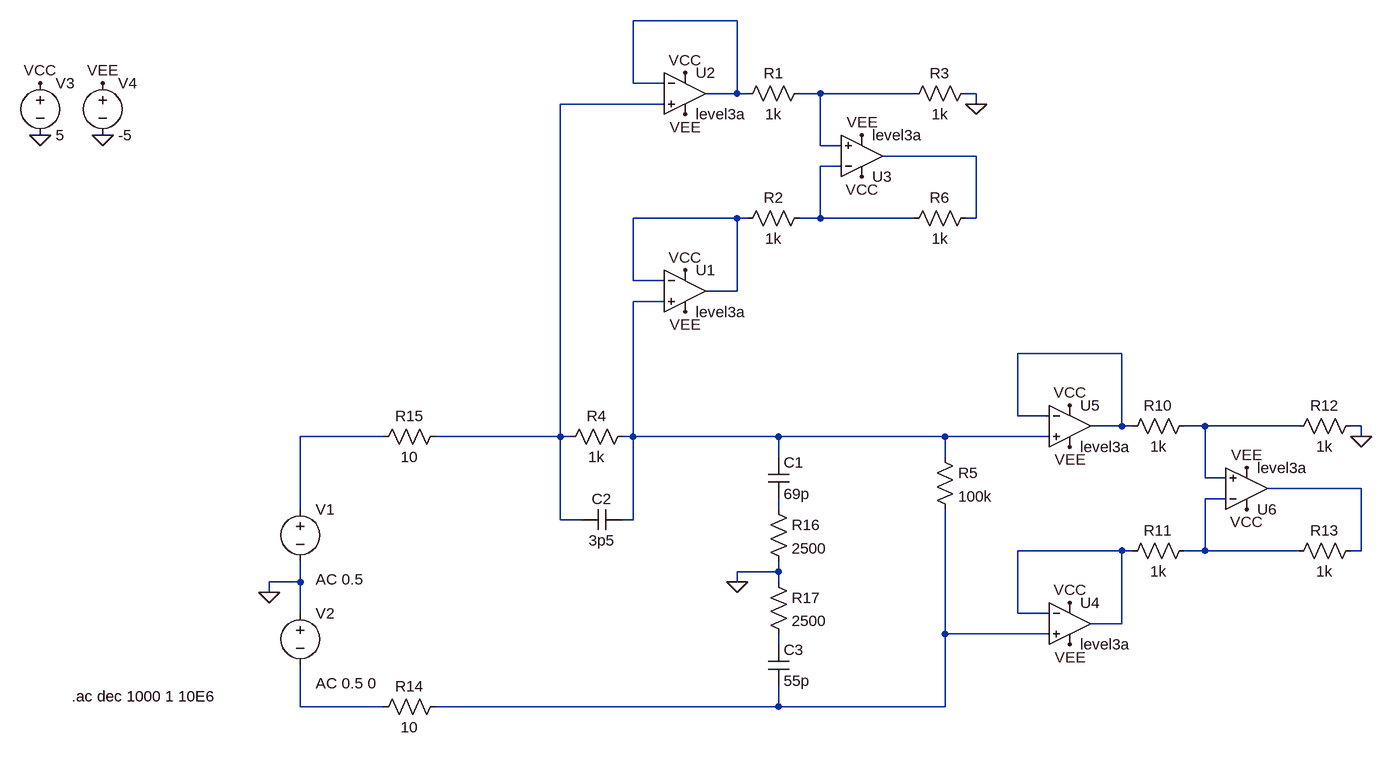
[diagram p0: schematic OpenShort.asc]
OpenShort.asc, the LTspice schematic file:
Version 4
SHEET 1 2248 1300
WIRE 368 128 208 128
WIRE 208 224 208 128
WIRE 256 224 208 224
WIRE 368 240 368 128
WIRE 368 240 320 240
WIRE 384 240 368 240
WIRE 496 240 464 240
WIRE 640 240 496 240
WIRE 736 240 720 240
WIRE 256 256 96 256
WIRE 736 256 736 240
WIRE 496 320 496 240
WIRE 528 320 496 320
WIRE 736 336 592 336
WIRE 528 352 496 352
WIRE 368 432 208 432
WIRE 384 432 368 432
WIRE 496 432 496 352
WIRE 496 432 464 432
WIRE 640 432 496 432
WIRE 736 432 736 336
WIRE 736 432 720 432
WIRE 208 528 208 432
WIRE 256 528 208 528
WIRE 368 544 368 432
WIRE 368 544 320 544
WIRE 256 560 208 560
WIRE 960 640 800 640
WIRE 800 736 800 640
WIRE 848 736 800 736
WIRE 960 752 960 640
WIRE 960 752 912 752
WIRE 976 752 960 752
WIRE 1088 752 1056 752
WIRE 1232 752 1088 752
WIRE 1328 752 1312 752
WIRE -176 768 -304 768
WIRE 96 768 96 256
WIRE 96 768 -96 768
WIRE 112 768 96 768
WIRE 208 768 208 560
WIRE 208 768 192 768
WIRE 432 768 208 768
WIRE 688 768 432 768
WIRE 848 768 688 768
WIRE 1328 768 1328 752
WIRE 432 800 432 768
WIRE 688 800 688 768
WIRE 1088 832 1088 752
WIRE 1120 832 1088 832
WIRE 1328 848 1184 848
WIRE 1120 864 1088 864
WIRE -304 880 -304 768
WIRE 432 880 432 864
WIRE 96 896 96 768
WIRE 128 896 96 896
WIRE 208 896 208 768
WIRE 208 896 192 896
WIRE 960 944 800 944
WIRE 976 944 960 944
WIRE 1088 944 1088 864
WIRE 1088 944 1056 944
WIRE 1232 944 1088 944
WIRE 1328 944 1328 848
WIRE 1328 944 1312 944
WIRE 432 976 432 960
WIRE 432 976 368 976
WIRE -304 992 -304 960
WIRE -304 992 -352 992
WIRE 368 992 368 976
WIRE 432 992 432 976
WIRE -352 1008 -352 992
WIRE -304 1040 -304 992
WIRE 800 1040 800 944
WIRE 848 1040 800 1040
WIRE 960 1056 960 944
WIRE 960 1056 912 1056
WIRE 688 1072 688 880
WIRE 848 1072 688 1072
WIRE 432 1088 432 1072
WIRE -304 1184 -304 1120
WIRE -176 1184 -304 1184
WIRE 432 1184 432 1152
WIRE 432 1184 -96 1184
WIRE 688 1184 688 1072
WIRE 688 1184 432 1184
FLAG -352 1008 0
FLAG -608 304 0
FLAG -704 304 0
FLAG -704 224 VCC
FLAG 288 512 VCC
FLAG -608 224 VEE
FLAG 288 576 VEE
FLAG 288 208 VCC
FLAG 288 272 VEE
FLAG 560 368 VCC
FLAG 560 304 VEE
FLAG 736 256 0
FLAG 880 1024 VCC
FLAG 880 1088 VEE
FLAG 880 720 VCC
FLAG 880 784 VEE
FLAG 1152 880 VCC
FLAG 1152 816 VEE
FLAG 1328 768 0
FLAG 368 992 0
SYMBOL res 96 784 R270
WINDOW 0 32 56 VTop 2
WINDOW 3 0 56 VBottom 2
SYMATTR InstName R4
SYMATTR Value 1k
SYMBOL voltage -304 864 R0
WINDOW 123 24 124 Left 2
WINDOW 39 0 0 Left 0
SYMATTR Value2 AC 0.5
SYMATTR InstName V1
SYMATTR Value ""
SYMBOL res 672 784 R0
SYMATTR InstName R5
SYMATTR Value 100k
SYMBOL cap 192 880 R90
WINDOW 0 0 32 VBottom 2
WINDOW 3 32 32 VTop 2
SYMATTR InstName C2
SYMATTR Value 3p5
SYMBOL voltage -304 1024 R0
WINDOW 123 24 124 Left 2
WINDOW 39 0 0 Left 0
SYMATTR Value2 AC 0.5 0
SYMATTR InstName V2
SYMATTR Value ""
SYMBOL OpAmps\\UniversalOpAmp3 288 544 R0
SYMATTR InstName U1
SYMATTR Value2 Avol=100Meg GBW=10000000000Meg Slew=10000000000Meg
SYMATTR SpiceLine2 En=0 Enk=0 In=0 Ink=0 Rin=500000000Meg
SYMBOL voltage -704 208 R0
WINDOW 123 0 0 Left 0
WINDOW 39 0 0 Left 0
SYMATTR InstName V3
SYMATTR Value 5
SYMBOL voltage -608 208 R0
WINDOW 123 0 0 Left 0
WINDOW 39 0 0 Left 0
SYMATTR InstName V4
SYMATTR Value -5
SYMBOL OpAmps\\UniversalOpAmp3 288 240 R0
SYMATTR InstName U2
SYMATTR Value2 Avol=100Meg GBW=10000000000Meg Slew=10000000000Meg
SYMATTR SpiceLine2 En=0 Enk=0 In=0 Ink=0 Rin=500000000Meg
SYMBOL res 480 224 R90
WINDOW 0 0 56 VBottom 2
WINDOW 3 32 56 VTop 2
SYMATTR InstName R1
SYMATTR Value 1k
SYMBOL res 480 416 R90
WINDOW 0 0 56 VBottom 2
WINDOW 3 32 56 VTop 2
SYMATTR InstName R2
SYMATTR Value 1k
SYMBOL res 736 224 R90
WINDOW 0 0 56 VBottom 2
WINDOW 3 32 56 VTop 2
SYMATTR InstName R3
SYMATTR Value 1k
SYMBOL res 736 416 R90
WINDOW 0 0 56 VBottom 2
WINDOW 3 32 56 VTop 2
SYMATTR InstName R6
SYMATTR Value 1k
SYMBOL OpAmps\\UniversalOpAmp3 560 336 M180
SYMATTR InstName U3
SYMATTR Value2 Avol=100Meg GBW=10000000000Meg Slew=10000000000Meg
SYMATTR SpiceLine2 En=0 Enk=0 In=0 Ink=0 Rin=500000000Meg
SYMBOL OpAmps\\UniversalOpAmp3 880 1056 R0
SYMATTR InstName U4
SYMATTR Value2 Avol=100Meg GBW=10000000000Meg Slew=10000000000Meg
SYMATTR SpiceLine2 En=0 Enk=0 In=0 Ink=0 Rin=500000000Meg
SYMBOL OpAmps\\UniversalOpAmp3 880 752 R0
SYMATTR InstName U5
SYMATTR Value2 Avol=100Meg GBW=10000000000Meg Slew=10000000000Meg
SYMATTR SpiceLine2 En=0 Enk=0 In=0 Ink=0 Rin=500000000Meg
SYMBOL res 1072 736 R90
WINDOW 0 0 56 VBottom 2
WINDOW 3 32 56 VTop 2
SYMATTR InstName R10
SYMATTR Value 1k
SYMBOL res 1072 928 R90
WINDOW 0 0 56 VBottom 2
WINDOW 3 32 56 VTop 2
SYMATTR InstName R11
SYMATTR Value 1k
SYMBOL res 1328 736 R90
WINDOW 0 0 56 VBottom 2
WINDOW 3 32 56 VTop 2
SYMATTR InstName R12
SYMATTR Value 1k
SYMBOL res 1328 928 R90
WINDOW 0 0 56 VBottom 2
WINDOW 3 32 56 VTop 2
SYMATTR InstName R13
SYMATTR Value 1k
SYMBOL OpAmps\\UniversalOpAmp3 1152 848 M180
SYMATTR InstName U6
SYMATTR Value2 Avol=100Meg GBW=10000000000Meg Slew=10000000000Meg
SYMATTR SpiceLine2 En=0 Enk=0 In=0 Ink=0 Rin=500000000Meg
SYMBOL res -80 1168 R90
WINDOW 0 0 56 VBottom 2
WINDOW 3 32 56 VTop 2
SYMATTR InstName R14
SYMATTR Value 10
SYMBOL res -80 752 R90
WINDOW 0 0 56 VBottom 2
WINDOW 3 32 56 VTop 2
SYMATTR InstName R15
SYMATTR Value 10
SYMBOL cap 416 800 R0
SYMATTR InstName C1
SYMATTR Value 69p
SYMBOL res 416 864 R0
SYMATTR InstName R16
SYMATTR Value 2500
SYMBOL cap 416 1088 R0
SYMATTR InstName C3
SYMATTR Value 55p
SYMBOL res 416 976 R0
SYMATTR InstName R17
SYMATTR Value 2500
TEXT -656 1168 Left 2 !.ac dec 1000 1 10E6

The netlist it stands for:
* OpenShort.asc
R4 N003 N007 1k
V1 N010 0 AC 0.5
R5 N007 N015 100k
C2 N007 N003 3p5
V2 0 N017 AC 0.5 0
XU1 N007 N006 VCC VEE N006 level3a Avol=100Meg GBW=10000000000Meg Slew=10000000000Meg En=0 Enk=0 In=0 Ink=0 Rin=500000000Meg  ; pins In+ In- V+ V- OUT
V3 VCC 0 5
V4 VEE 0 -5
XU2 N003 N001 VCC VEE N001 level3a Avol=100Meg GBW=10000000000Meg Slew=10000000000Meg En=0 Enk=0 In=0 Ink=0 Rin=500000000Meg  ; pins In+ In- V+ V- OUT
R1 N002 N001 1k
R2 N005 N006 1k
R3 0 N002 1k
R6 N004 N005 1k
XU3 N002 N005 VCC VEE N004 level3a Avol=100Meg GBW=10000000000Meg Slew=10000000000Meg En=0 Enk=0 In=0 Ink=0 Rin=500000000Meg  ; pins In+ In- V+ V- OUT
XU4 N015 N014 VCC VEE N014 level3a Avol=100Meg GBW=10000000000Meg Slew=10000000000Meg En=0 Enk=0 In=0 Ink=0 Rin=500000000Meg  ; pins In+ In- V+ V- OUT
XU5 N007 N008 VCC VEE N008 level3a Avol=100Meg GBW=10000000000Meg Slew=10000000000Meg En=0 Enk=0 In=0 Ink=0 Rin=500000000Meg  ; pins In+ In- V+ V- OUT
R10 N009 N008 1k
R11 N012 N014 1k
R12 0 N009 1k
R13 N011 N012 1k
XU6 N009 N012 VCC VEE N011 level3a Avol=100Meg GBW=10000000000Meg Slew=10000000000Meg En=0 Enk=0 In=0 Ink=0 Rin=500000000Meg  ; pins In+ In- V+ V- OUT
R14 N015 N017 10
R15 N003 N010 10
C1 N007 N013 69p
R16 N013 0 2500
C3 N016 N015 55p
R17 0 N016 2500
.ac dec 1000 1 10E6
.backanno
.end